# Altium schematic sheet Part D.SchDoc
size A4; SheetNumber: 11; SheetTotal: 16
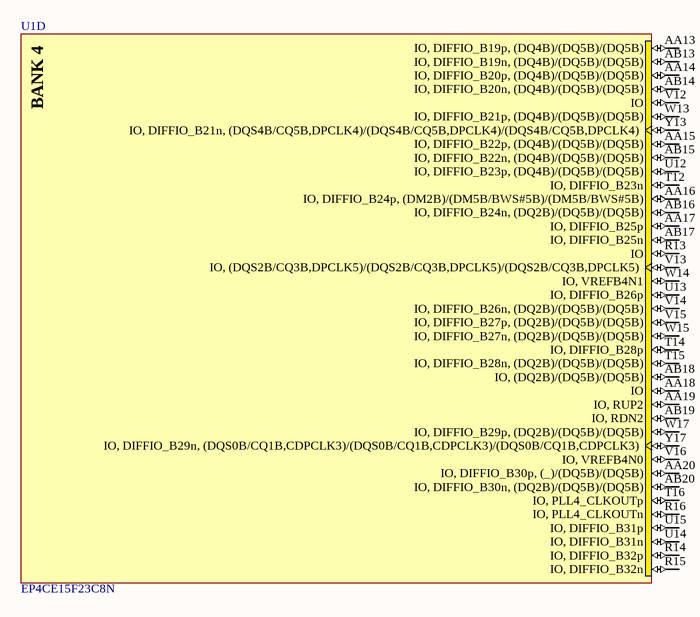
[diagram p0: Part D.SchDoc]

## Parts
U1  EP4CE15F23C8N  [FBGA484_A-240]  (part D of 13)

## Nets

Not connected (* = marked no-connect by the designer): U1 AA13(IO,_DIFFIO_B19p,_(DQ4B)/(DQ5B)/(DQ5B)) AA14(IO,_DIFFIO_B20p,_(DQ4B)/(DQ5B)/(DQ5B)) AA15(IO,_DIFFIO_B22p,_(DQ4B)/(DQ5B)/(DQ5B)) AA16(IO,_DIFFIO_B24p,_(DM2B)/(DM5B/BWS#5B)/(DM5B/BWS#5B)) AA17(IO,_DIFFIO_B25p) AA18(IO) AA19(IO,_RUP2) AA20(IO,_DIFFIO_B30p,_(_)/(DQ5B)/(DQ5B)) AB13(IO,_DIFFIO_B19n,_(DQ4B)/(DQ5B)/(DQ5B)) AB14(IO,_DIFFIO_B20n,_(DQ4B)/(DQ5B)/(DQ5B)) AB15(IO,_DIFFIO_B22n,_(DQ4B)/(DQ5B)/(DQ5B)) AB16(IO,_DIFFIO_B24n,_(DQ2B)/(DQ5B)/(DQ5B)) AB17(IO,_DIFFIO_B25n) AB18(IO,_(DQ2B)/(DQ5B)/(DQ5B)) AB19(IO,_RDN2) AB20(IO,_DIFFIO_B30n,_(DQ2B)/(DQ5B)/(DQ5B)) R13(IO) R14(IO,_DIFFIO_B32p) R15(IO,_DIFFIO_B32n) R16(IO,_PLL4_CLKOUTn) T12(IO,_DIFFIO_B23n) T14(IO,_DIFFIO_B28p) T15(IO,_DIFFIO_B28n,_(DQ2B)/(DQ5B)/(DQ5B)) T16(IO,_PLL4_CLKOUTp) U12(IO,_DIFFIO_B23p,_(DQ4B)/(DQ5B)/(DQ5B)) U13(IO,_DIFFIO_B26p) U14(IO,_DIFFIO_B31n) U15(IO,_DIFFIO_B31p) V12(IO) V13(IO,_(DQS2B/CQ3B,DPCLK5)/(DQS2B/CQ3B,DPCLK5)/(DQS2B/CQ3B,DPCLK5)) V14(IO,_DIFFIO_B26n,_(DQ2B)/(DQ5B)/(DQ5B)) V15(IO,_DIFFIO_B27p,_(DQ2B)/(DQ5B)/(DQ5B)) V16(IO,_VREFB4N0) W13(IO,_DIFFIO_B21p,_(DQ4B)/(DQ5B)/(DQ5B)) W14(IO,_VREFB4N1) W15(IO,_DIFFIO_B27n,_(DQ2B)/(DQ5B)/(DQ5B)) W17(IO,_DIFFIO_B29p,_(DQ2B)/(DQ5B)/(DQ5B)) Y13(IO,_DIFFIO_B21n,_(DQS4B/CQ5B,DPCLK4)/(DQS4B/CQ5B,DPCLK4)/(DQS4B/CQ5B,DPCLK4)) Y17(IO,_DIFFIO_B29n,_(DQS0B/CQ1B,CDPCLK3)/(DQS0B/CQ1B,CDPCLK3)/(DQS0B/CQ1B,CDPCLK3))

## Notes on the sheet
- (in symbol FPGA_EP4CE15F23C8N, part D) BANK 4

## Library data of the parts
U1 = FPGA_EP4CE15F23C8N: Cyclone IV Family FPGA, 1.2V Core, 343 I/O Pins, 4 PLLs, 484-Pin FBGA, Speed Grade 8, Commercial Grade, Pb-Free; Manufacturer: Altera; PackageVersion: ver1.0, Jun-2011; PackageReference: FBGA484_A-240; ComponentLink3URL: http://www.altera.com/literature/lit-dp.jsp?category=cyc%204&showspreadsheet=y; ComponentLink1Description: Manufacturer URL; DatasheetVersion: ver1.6, Nov-2011; ComponentLink3Description: Pinout; ComponentLink2URL: http://www.altera.com/literature/hb/cyclone-iv/cyclone4-handbook.pdf; ComponentLink1URL: http://www.altera.com/; ComponentLink2Description: Handbook; PackageDescription: 484-Pin FineLine Ball Grid Array (FBGA) - Wire Bond - A:2.40; Code_JEDEC: MS-034-AAJ-1; ComponentLink4URL: http://www.altera.com/devicepackaging/04R00247-02.pdf; ComponentLink4Description: Package Specification